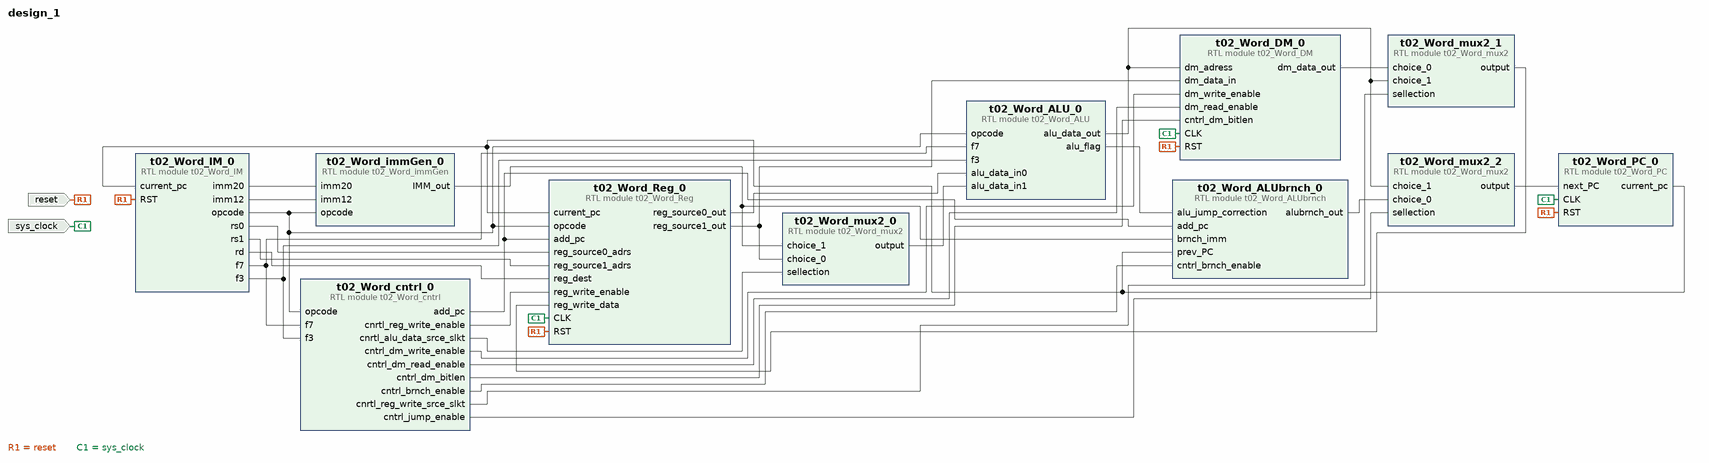
[diagram p0: block diagram of the top level]
# Vivado block design design_1, xc7a35tcpg236-1, Vivado 2020.1
create_bd_design design_1

create_bd_port -dir I -type clk sys_clock
set_property -dict {CONFIG.FREQ_HZ 100000000 CONFIG.PHASE 0.000} [get_bd_ports sys_clock]
create_bd_port -dir I -type rst reset
set_property -dict {CONFIG.POLARITY ACTIVE_HIGH} [get_bd_ports reset]

create_bd_cell -type module -reference t02_Word_PC t02_Word_PC_0
create_bd_cell -type module -reference t02_Word_IM t02_Word_IM_0
create_bd_cell -type module -reference t02_Word_Reg t02_Word_Reg_0
create_bd_cell -type module -reference t02_Word_immGen t02_Word_immGen_0
create_bd_cell -type module -reference t02_Word_ALU t02_Word_ALU_0
create_bd_cell -type module -reference t02_Word_DM t02_Word_DM_0
create_bd_cell -type module -reference t02_Word_cntrl t02_Word_cntrl_0
create_bd_cell -type module -reference t02_Word_mux2 t02_Word_mux2_0
create_bd_cell -type module -reference t02_Word_mux2 t02_Word_mux2_1
create_bd_cell -type module -reference t02_Word_mux2 t02_Word_mux2_2
create_bd_cell -type module -reference t02_Word_ALUbrnch t02_Word_ALUbrnch_0

# ---- connections ----

connect_bd_net [get_bd_ports reset] \
  [get_bd_pins t02_Word_PC_0/RST] [get_bd_pins t02_Word_IM_0/RST] [get_bd_pins t02_Word_Reg_0/RST] \
  [get_bd_pins t02_Word_DM_0/RST]
connect_bd_net [get_bd_ports sys_clock] [get_bd_pins t02_Word_PC_0/CLK] [get_bd_pins t02_Word_Reg_0/CLK] [get_bd_pins t02_Word_DM_0/CLK]
connect_bd_net [get_bd_pins t02_Word_PC_0/current_pc] \
  [get_bd_pins t02_Word_IM_0/current_pc] [get_bd_pins t02_Word_Reg_0/current_pc] [get_bd_pins t02_Word_ALUbrnch_0/prev_PC]
connect_bd_net [get_bd_pins t02_Word_cntrl_0/add_pc] [get_bd_pins t02_Word_Reg_0/add_pc] [get_bd_pins t02_Word_ALUbrnch_0/add_pc]
connect_bd_net [get_bd_pins t02_Word_IM_0/opcode] \
  [get_bd_pins t02_Word_Reg_0/opcode] [get_bd_pins t02_Word_immGen_0/opcode] [get_bd_pins t02_Word_ALU_0/opcode] \
  [get_bd_pins t02_Word_cntrl_0/opcode]
connect_bd_net [get_bd_pins t02_Word_IM_0/rs0] [get_bd_pins t02_Word_Reg_0/reg_source0_adrs]
connect_bd_net [get_bd_pins t02_Word_IM_0/rs1] [get_bd_pins t02_Word_Reg_0/reg_source1_adrs]
connect_bd_net [get_bd_pins t02_Word_IM_0/rd] [get_bd_pins t02_Word_Reg_0/reg_dest]
connect_bd_net [get_bd_pins t02_Word_IM_0/imm20] [get_bd_pins t02_Word_immGen_0/imm20]
connect_bd_net [get_bd_pins t02_Word_IM_0/imm12] [get_bd_pins t02_Word_immGen_0/imm12]
connect_bd_net [get_bd_pins t02_Word_immGen_0/IMM_out] [get_bd_pins t02_Word_mux2_0/choice_1] [get_bd_pins t02_Word_ALUbrnch_0/brnch_imm]
connect_bd_net [get_bd_pins t02_Word_IM_0/f7] [get_bd_pins t02_Word_ALU_0/f7] [get_bd_pins t02_Word_cntrl_0/f7]
connect_bd_net [get_bd_pins t02_Word_IM_0/f3] [get_bd_pins t02_Word_ALU_0/f3] [get_bd_pins t02_Word_cntrl_0/f3]
connect_bd_net [get_bd_pins t02_Word_Reg_0/reg_source0_out] [get_bd_pins t02_Word_ALU_0/alu_data_in0]
connect_bd_net [get_bd_pins t02_Word_ALU_0/alu_data_out] \
  [get_bd_pins t02_Word_DM_0/dm_adress] [get_bd_pins t02_Word_mux2_2/choice_1] [get_bd_pins t02_Word_mux2_1/choice_1]
connect_bd_net [get_bd_pins t02_Word_Reg_0/reg_source1_out] [get_bd_pins t02_Word_DM_0/dm_data_in] [get_bd_pins t02_Word_mux2_0/choice_0]
connect_bd_net [get_bd_pins t02_Word_cntrl_0/cntrl_dm_write_enable] [get_bd_pins t02_Word_DM_0/dm_write_enable]
connect_bd_net [get_bd_pins t02_Word_cntrl_0/cntrl_dm_read_enable] [get_bd_pins t02_Word_DM_0/dm_read_enable]
connect_bd_net [get_bd_pins t02_Word_cntrl_0/cntrl_dm_bitlen] [get_bd_pins t02_Word_DM_0/cntrl_dm_bitlen]
connect_bd_net [get_bd_pins t02_Word_cntrl_0/cntrl_brnch_enable] [get_bd_pins t02_Word_ALUbrnch_0/cntrl_brnch_enable]
connect_bd_net [get_bd_pins t02_Word_cntrl_0/cnrtl_reg_write_enable] [get_bd_pins t02_Word_Reg_0/reg_write_enable]
connect_bd_net [get_bd_pins t02_Word_cntrl_0/cnrtl_alu_data_srce_slkt] [get_bd_pins t02_Word_mux2_0/sellection]
connect_bd_net [get_bd_pins t02_Word_mux2_0/output] [get_bd_pins t02_Word_ALU_0/alu_data_in1]
connect_bd_net [get_bd_pins t02_Word_cntrl_0/cnrtl_reg_write_srce_slkt] [get_bd_pins t02_Word_mux2_1/sellection]
connect_bd_net [get_bd_pins t02_Word_DM_0/dm_data_out] [get_bd_pins t02_Word_mux2_1/choice_0]
connect_bd_net [get_bd_pins t02_Word_mux2_1/output] [get_bd_pins t02_Word_Reg_0/reg_write_data]
connect_bd_net [get_bd_pins t02_Word_ALUbrnch_0/alubrnch_out] [get_bd_pins t02_Word_mux2_2/choice_0]
connect_bd_net [get_bd_pins t02_Word_cntrl_0/cntrl_jump_enable] [get_bd_pins t02_Word_mux2_2/sellection]
connect_bd_net [get_bd_pins t02_Word_mux2_2/output] [get_bd_pins t02_Word_PC_0/next_PC]
connect_bd_net [get_bd_pins t02_Word_ALU_0/alu_flag] [get_bd_pins t02_Word_ALUbrnch_0/alu_jump_correction]

validate_bd_design
save_bd_design
